# Altium project MABSS_V3.PrjPcb
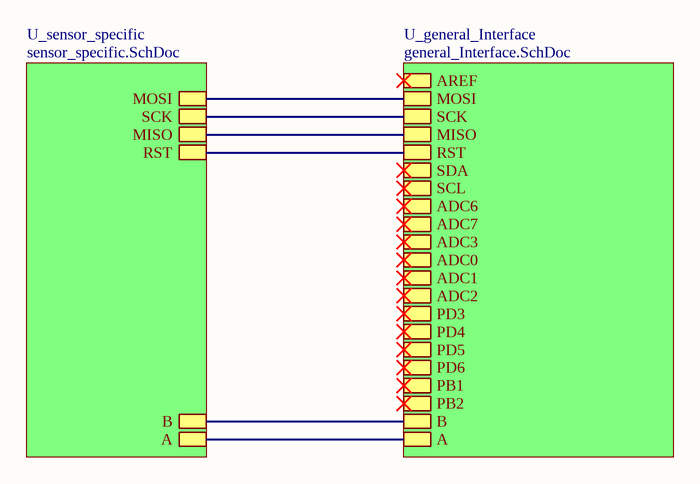
[diagram p0: master_sheet.SchDoc]
3 sheets, 13 parts. Net scope: hierarchical (ports join the sheet entries above them; power ports are global).
Sheets:
  master_sheet.SchDoc
    U_general_Interface = general_Interface.SchDoc
    U_sensor_specific = sensor_specific.SchDoc

## Sheet master_sheet.SchDoc
size A4

### Sub-sheets
U_general_Interface = general_Interface.SchDoc: AREF, MOSI, SCK, MISO, RST, SDA, SCL, ADC6, ADC7, ADC3, ADC0, ADC1, ADC2, PD3, PD4, PD5, PD6, PB1, PB2, B, A
U_sensor_specific = sensor_specific.SchDoc: MOSI, SCK, MISO, RST, B, A

### Nets
NetP1_1: sheet U_general_Interface/RST, sheet U_sensor_specific/RST
NetP1_2: sheet U_general_Interface/MISO, sheet U_sensor_specific/MISO
NetP1_3: sheet U_general_Interface/SCK, sheet U_sensor_specific/SCK
NetP1_4: sheet U_general_Interface/MOSI, sheet U_sensor_specific/MOSI
NetP2_2: sheet U_general_Interface/A, sheet U_sensor_specific/A
NetP2_3: sheet U_general_Interface/B, sheet U_sensor_specific/B

## Sheet general_Interface.SchDoc
size A4
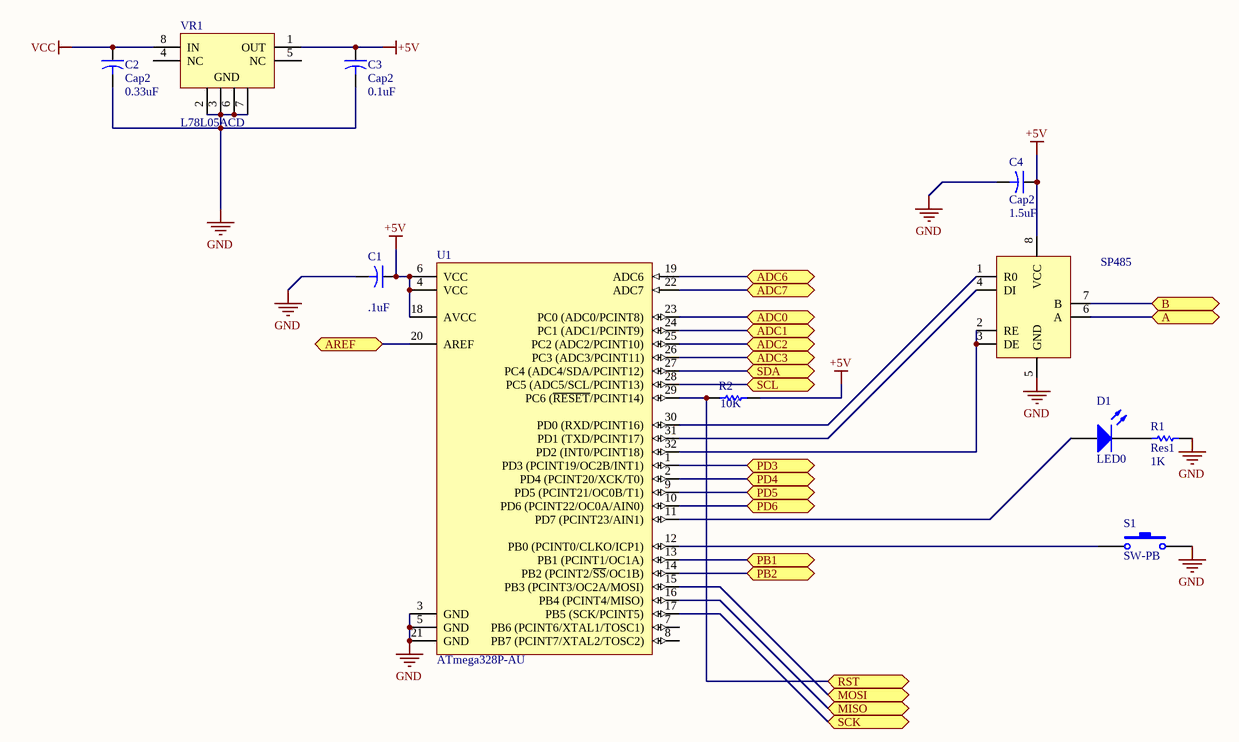
[diagram p1: general_Interface.SchDoc]

### Parts
C1  value .1uF  [6-0805_M]
C2  Cap2  value 0.33uF  [6-0805_M]
C3  Cap2  value 0.1uF  [6-0805_M]
C4  Cap2  value 1.5uF  [6-0805_M]
D1  LED0  [1608[0603]]
R1  Res1  value 1K  [0603]
R2  value 10K  [0603]
S1  SW-PB  [ADTSM3]
SP485  SP485  [SO8_M]  (value not drawn)
U1  ATmega328P-AU  [32A_M]
VR1  L78L05ACD  [SO8_N]

### Ports
A, ADC0, ADC1, ADC2, ADC3, ADC6, ADC7, AREF, B, MISO, MOSI, PB1, PB2, PD3, PD4, PD5, PD6, RST, SCK, SCL, SDA

### Nets
+5V: C1.1 C3.1 C4.1 R2.2 SP485.8(VCC) U1.4(VCC) U1.6(VCC) U1.18(AVCC) VR1.1(OUT)
GND: C1.2 C2.2 C3.2 C4.2 R1.2 S1.2 SP485.5(GND) U1.3(GND) U1.5(GND) U1.21(GND) VR1.2(GND) VR1.3(GND) VR1.6(GND) VR1.7(GND)
VCC: C2.1 VR1.8(IN)
NetD1_1: D1.1(A) U1.11(PD7_(PCINT23/AIN1))
NetD1_2: D1.2(K) R1.1
NetP1_1: R2.1 U1.29(PC6_(~{RESET}/PCINT14)) ; port RST
NetP1_2: U1.16(PB4_(PCINT4/MISO)) ; port MISO
NetP1_3: U1.17(PB5_(SCK/PCINT5)) ; port SCK
NetP1_4: U1.15(PB3_(PCINT3/OC2A/MOSI)) ; port MOSI
NetP2_2: SP485.6(A) ; port A
NetP2_3: SP485.7(B) ; port B
NetS1_1: S1.1 U1.12(PB0_(PCINT0/CLKO/ICP1))
NetSP485_1: SP485.1(R0) U1.30(PD0_(RXD/PCINT16))
NetSP485_2: SP485.2(RE) SP485.3(DE) U1.32(PD2_(INT0/PCINT18))
NetSP485_4: SP485.4(DI) U1.31(PD1_(TXD/PCINT17))
NetU1_1: U1.1(PD3_(PCINT19/OC2B/INT1)) ; port PD3
NetU1_2: U1.2(PD4_(PCINT20/XCK/T0)) ; port PD4
NetU1_9: U1.9(PD5_(PCINT21/OC0B/T1)) ; port PD5
NetU1_10: U1.10(PD6_(PCINT22/OC0A/AIN0)) ; port PD6
NetU1_13: U1.13(PB1_(PCINT1/OC1A)) ; port PB1
NetU1_14: U1.14(PB2_(PCINT2/~{SS}/OC1B)) ; port PB2
NetU1_19: U1.19(ADC6) ; port ADC6
NetU1_20: U1.20(AREF) ; port AREF
NetU1_22: U1.22(ADC7) ; port ADC7
NetU1_23: U1.23(PC0_(ADC0/PCINT8)) ; port ADC0
NetU1_24: U1.24(PC1_(ADC1/PCINT9)) ; port ADC1
NetU1_25: U1.25(PC2_(ADC2/PCINT10)) ; port ADC2
NetU1_26: U1.26(PC3_(ADC3/PCINT11)) ; port ADC3
NetU1_27: U1.27(PC4_(ADC4/SDA/PCINT12)) ; port SDA
NetU1_28: U1.28(PC5_(ADC5/SCL/PCINT13)) ; port SCL

Not connected (* = marked no-connect by the designer): U1 7(PB6_(PCINT6/XTAL1/TOSC1)) 8(PB7_(PCINT7/XTAL2/TOSC2)); VR1 4(NC) 5(NC)

### Library data of the parts
C1-C4 = Cap2: Capacitor; Published: 23-Sep-2002; PackageReference: CAPR5-4X5; Publisher: Altium Limited; PackageDescription: Capacitor; 2 Leads
D1 = LED0: Typical INFRARED GaAs LED; Published: 8-Jun-2000; LatestRevisionDate: 08-Jul-2005; LatestRevisionNote: Mech Layer 1 removed.; PackageReference: LED-0; Publisher: Altium Limited; PackageDescription: LED; 2 Leads
R1 R2 = Res1: Resistor; Published: 8-Jun-2000; LatestRevisionDate: 17-Jul-2002; LatestRevisionNote: Re-released for DXP Platform.; PackageReference: AXIAL-0.3; Publisher: Altium Limited; PackageDescription: Axial Device, Thru-Hole; 2 Leads; 0.3 in Pin Spacing
S1 = SW-PB: Switch; Published: 24-Mar-1999; LatestRevisionDate: 17-Jul-2002; LatestRevisionNote: Re-released for DXP Platform.; PackageReference: SPST-2; Publisher: Altium Limited; PackageDescription: Switch; 2 Leads
SP485 = SP485: SN75176
U1 = ATmega328P-AU: 8-bit AVR Microcontroller, 32KB Flash, 1KB EEPROM, 2KB SRAM, 32-pin TQFP, Industrial Grade (-40°C to 85°C); DatasheetVersion: revD, May-2011; PackageVersion: revC, Oct-2010; PackageReference: 32A; PackageDescription: 32-Lead, 7x7x1.0 mm Body, 0.8mm Lead Pitch, Thin Profile Plastic Quad Flat Package (TQFP); Code_JEDEC: MS-026-ABA; ComponentLink1Description: Manufacturer URL; ComponentLink1URL: http://www.atmel.com/; ComponentLink2Description: ATmega48A/48PA/88A/88PA/168A/168PA/328/328P Datasheet; ComponentLink2URL: http://www.atmel.com/dyn/resources/prod_documents/doc8271.pdf; ComponentLink3Description: ATmega48A/48PA/88A/88PA/168A/168PA/328/328P Summary; ComponentLink3URL: http://www.atmel.com/dyn/resources/prod_documents/8271S.pdf
VR1 = L78L05ACD: Positive Voltage Regulator; Published: 24-Aug-2001; LatestRevisionDate: 13-Apr-2006; LatestRevisionNote: IPC-7351 Footprint Added.; DatasheetVersion: Feb-1999; PackageVersion: Dec-2002; PackageReference: SO8; Publisher: Altium Limited; PackageDescription: 8-Pin Small Outline Integrated Circuit 1.27 mm Pitch; Code_JEDEC: MS-012-AA; Code_IPC: SOIC127P600-8; ComponentLink1Description: Manufacturer Link; ComponentLink1URL: http://www.st.com/

## Sheet sensor_specific.SchDoc
size A4
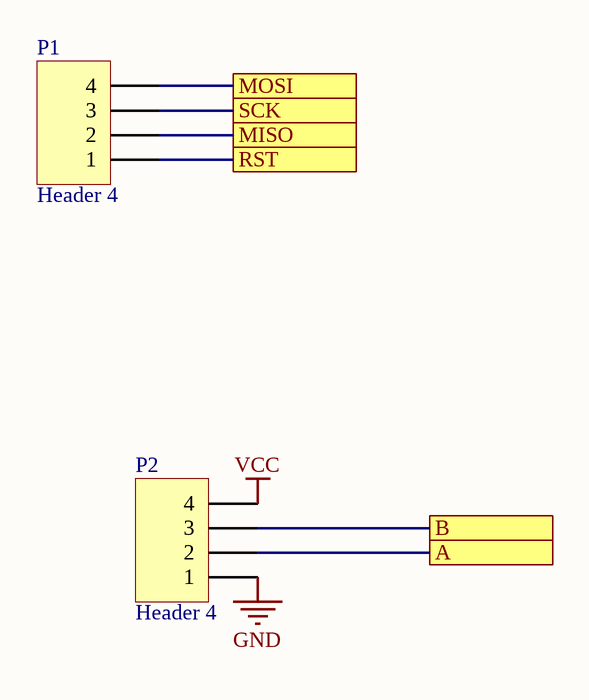
[diagram p2: sensor_specific.SchDoc]

### Parts
P1  Header 4  [HDR1X4]
P2  Header 4  [HDR1X4]

### Ports
A, B, MISO, MOSI, RST, SCK

### Nets
GND: P2.1
VCC: P2.4
NetP1_1: P1.1 ; port RST
NetP1_2: P1.2 ; port MISO
NetP1_3: P1.3 ; port SCK
NetP1_4: P1.4 ; port MOSI
NetP2_2: P2.2 ; port A
NetP2_3: P2.3 ; port B

### Library data of the parts
P1 P2 = Header 4: Header, 4-Pin; LatestRevisionDate: 17-Jul-2002; LatestRevisionNote: Re-released for DXP Platform.; Publisher: Altium Limited

## Nets that join several sheets
GND: general_Interface (14 pins), sensor_specific (P2.1)
VCC: general_Interface (C2.1 VR1.8), sensor_specific (P2.4)
NetP1_1: general_Interface (R2.1 U1.29), sensor_specific (P1.1)
NetP1_2: general_Interface (U1.16), sensor_specific (P1.2)
NetP1_3: general_Interface (U1.17), sensor_specific (P1.3)
NetP1_4: general_Interface (U1.15), sensor_specific (P1.4)
NetP2_2: general_Interface (SP485.6), sensor_specific (P2.2)
NetP2_3: general_Interface (SP485.7), sensor_specific (P2.3)